# EAGLE schematic cnc_driver_2 (EAGLE 7.6.0)
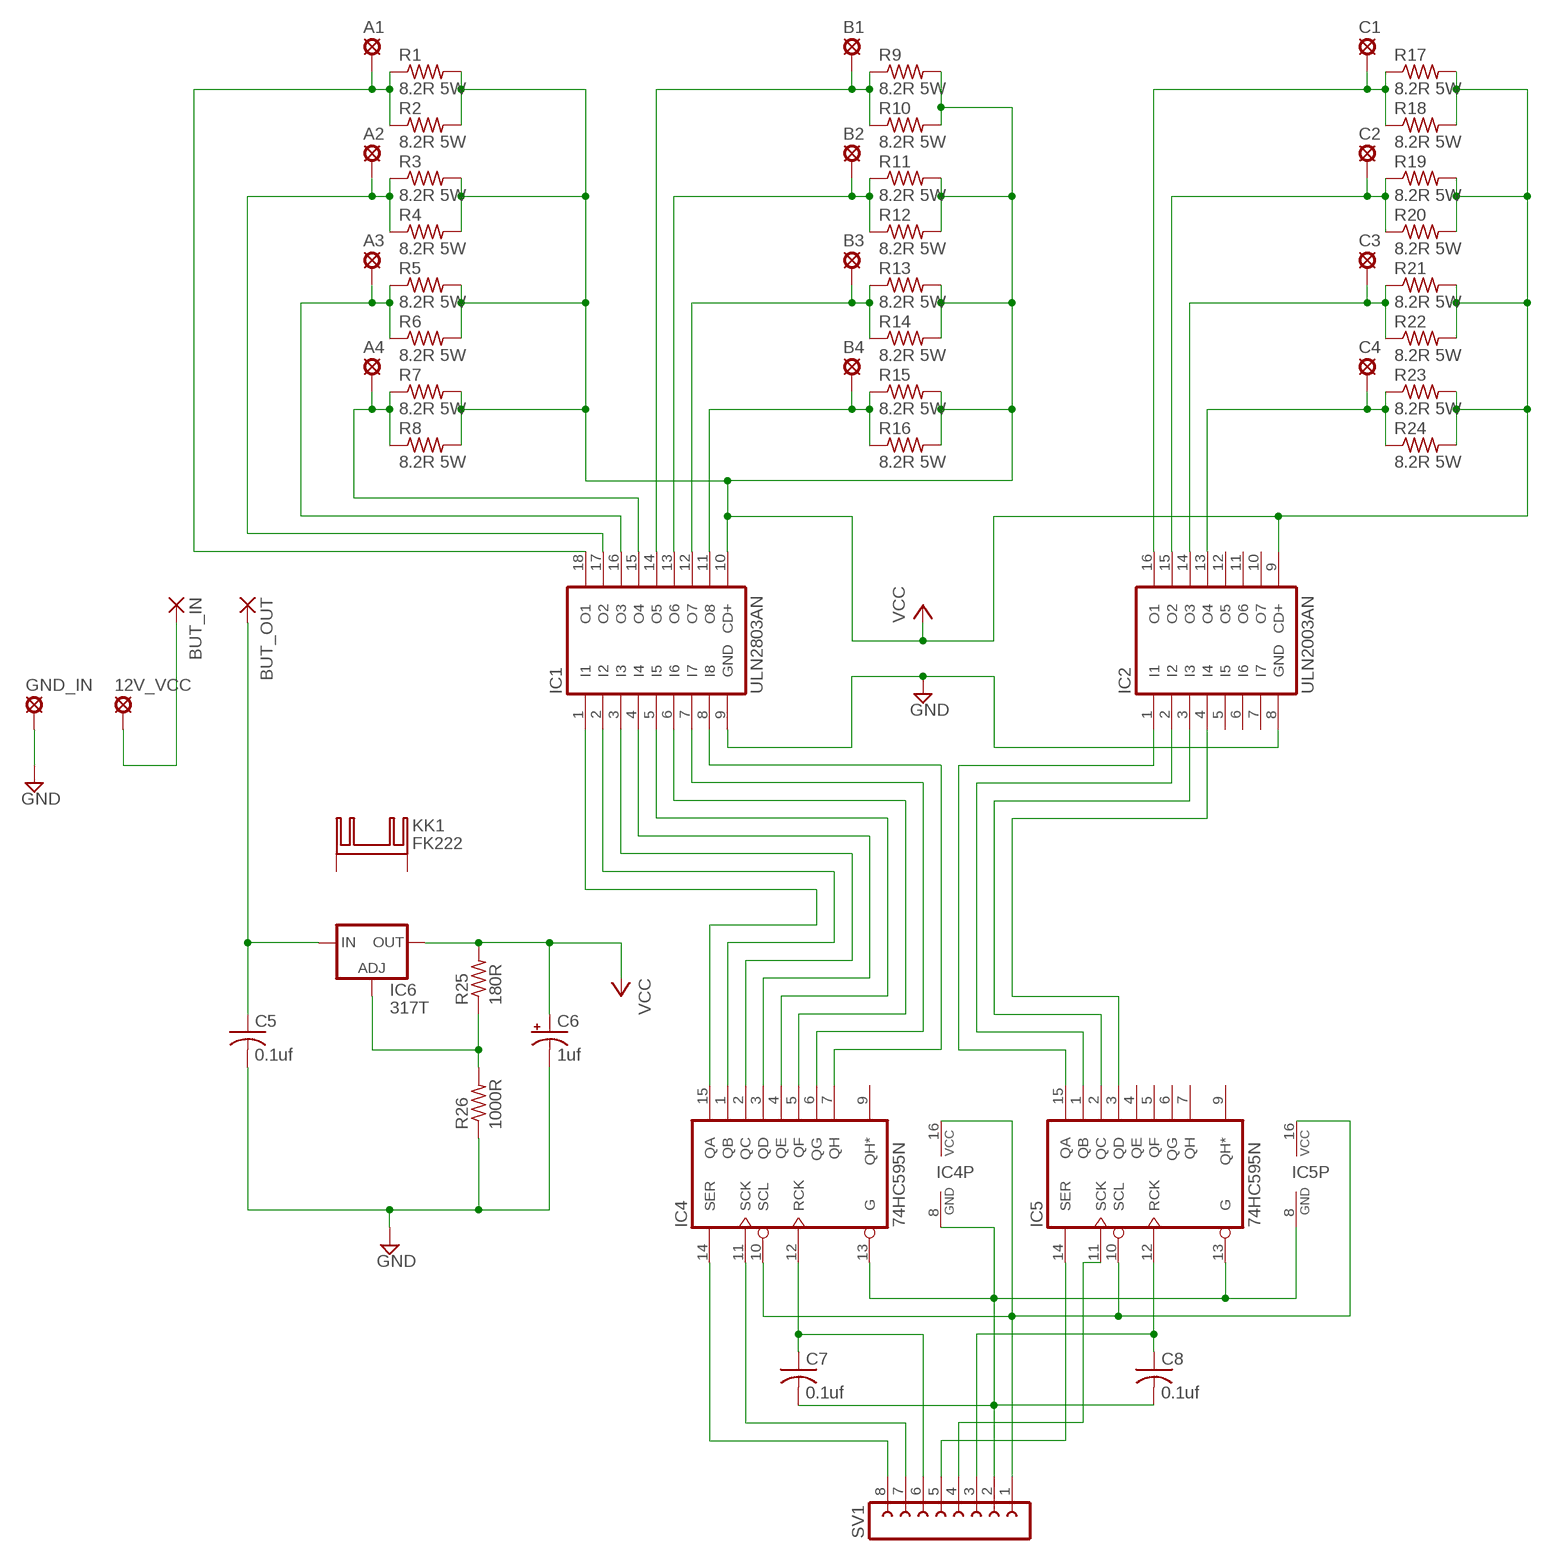
[diagram p0: schematic, sheet 1]

## Parts
12V_VCC  LSP13  [LSP13]
A1  LSP11  [LSP11]
A2  LSP11  [LSP11]
A3  LSP11  [LSP11]
A4  LSP11  [LSP11]
B1  LSP11  [LSP11]
B2  LSP11  [LSP11]
B3  LSP11  [LSP11]
B4  LSP11  [LSP11]
BUT_IN  3,81/1,4  [3,81/1,4]
BUT_OUT  3,81/1,4  [3,81/1,4]
C1  LSP11  [LSP11]
C2  LSP11  [LSP11]
C3  LSP11  [LSP11]
C4  LSP11  [LSP11]
C5  0.1uf  C-US025-025X050  [C025-025X050]
C6  1uf  CPOL-USE2-5  [E2-5]
C7  0.1uf  C-US025-025X050  [C025-025X050]
C8  0.1uf  C-US025-025X050  [C025-025X050]
GND_IN  LSP13  [LSP13]
IC1  ULN2803AN  ULN2803A  [DIL18]
IC2  ULN2003AN  [DIL16]
IC4  74HC595N  [DIL16]
IC5  74HC595N  [DIL16]
IC6  317T  LM317TS  [317TS]
KK1  FK222  [FK222]
R1  8.2R 5W  R-US_0617/5V  [0617V]
R2  8.2R 5W  R-US_0617/5V  [0617V]
R3  8.2R 5W  R-US_0617/5V  [0617V]
R4  8.2R 5W  R-US_0617/5V  [0617V]
R5  8.2R 5W  R-US_0617/5V  [0617V]
R6  8.2R 5W  R-US_0617/5V  [0617V]
R7  8.2R 5W  R-US_0617/5V  [0617V]
R8  8.2R 5W  R-US_0617/5V  [0617V]
R9  8.2R 5W  R-US_0617/5V  [0617V]
R10  8.2R 5W  R-US_0617/5V  [0617V]
R11  8.2R 5W  R-US_0617/5V  [0617V]
R12  8.2R 5W  R-US_0617/5V  [0617V]
R13  8.2R 5W  R-US_0617/5V  [0617V]
R14  8.2R 5W  R-US_0617/5V  [0617V]
R15  8.2R 5W  R-US_0617/5V  [0617V]
R16  8.2R 5W  R-US_0617/5V  [0617V]
R17  8.2R 5W  R-US_0617/5V  [0617V]
R18  8.2R 5W  R-US_0617/5V  [0617V]
R19  8.2R 5W  R-US_0617/5V  [0617V]
R20  8.2R 5W  R-US_0617/5V  [0617V]
R21  8.2R 5W  R-US_0617/5V  [0617V]
R22  8.2R 5W  R-US_0617/5V  [0617V]
R23  8.2R 5W  R-US_0617/5V  [0617V]
R24  8.2R 5W  R-US_0617/5V  [0617V]
R25  180R  R-US_0207/10  [0207/10]
R26  1000R  R-US_0207/10  [0207/10]
SV1  FE08-1  [FE08]

## Nets
GND: C5.2 C6.- GND_IN.MP IC1.9(GND) IC2.8(GND) R26.1
N$1: A1.MP IC1.18(O1) R1.1 R2.1
N$2: A2.MP IC1.17(O2) R3.1 R4.1
N$3: A3.MP IC1.16(O3) R5.1 R6.1
N$4: A4.MP IC1.15(O4) R7.1 R8.1
N$5: 12V_VCC.MP BUT_IN.1(P)
N$6: BUT_OUT.1(P) C5.1 IC6.3(IN)
N$7: IC4.10(SCL) IC4.16(VCC) IC5.10(SCL) IC5.16(VCC) SV1.1
N$8: IC6.1(ADJ) R25.1 R26.2
N$10: C7.2 C8.2 IC4.8(GND) IC4.13(G) IC5.8(GND) IC5.13(G) SV1.2
N$13: B1.MP IC1.14(O5) R9.1 R10.1
N$14: B2.MP IC1.13(O6) R11.1 R12.1
N$15: B3.MP IC1.12(O7) R13.1 R14.1
N$16: B4.MP IC1.11(O8) R15.1 R16.1
N$17: C1.MP IC2.16(O1) R17.1 R18.1
N$18: C2.MP IC2.15(O2) R19.1 R20.1
N$19: C3.MP IC2.14(O3) R21.1 R22.1
N$20: C4.MP IC2.13(O4) R23.1 R24.1
N$21: C8.1 IC5.12(RCK) SV1.3
N$22: C7.1 IC4.12(RCK) SV1.6
N$23: IC4.11(SCK) SV1.7
N$24: IC4.14(SER) SV1.8
N$25: IC1.1(I1) IC4.15(QA)
N$26: IC1.2(I2) IC4.1(QB)
N$27: IC1.3(I3) IC4.2(QC)
N$28: IC1.4(I4) IC4.3(QD)
N$29: IC1.5(I5) IC4.4(QE)
N$30: IC1.6(I6) IC4.5(QF)
N$31: IC1.7(I7) IC4.6(QG)
N$32: IC1.8(I8) IC4.7(QH)
N$33: IC2.1(I1) IC5.15(QA)
N$34: IC2.2(I2) IC5.1(QB)
N$35: IC2.3(I3) IC5.2(QC)
N$36: IC2.4(I4) IC5.3(QD)
N$37: IC5.14(SER) SV1.5
N$38: IC5.11(SCK) SV1.4
VCC: IC1.10(CD+) IC2.9(CD+) R1.2 R2.2 R3.2 R4.2 R5.2 R6.2 R7.2 R8.2 R9.2 R10.2 R11.2 R12.2 R13.2 R14.2 R15.2 R16.2 R17.2 R18.2 R19.2 R20.2 R21.2 R22.2 R23.2 R24.2
VCC_MOTOR: C6.+ IC6.2(OUT) R25.2 ; supply symbol labelled VCC
Unconnected: IC2.5(I5) IC2.6(I6) IC2.7(I7) IC2.10(O7) IC2.11(O6) IC2.12(O5) IC4.9(QH*) IC5.4(QE) IC5.5(QF) IC5.6(QG) IC5.7(QH) IC5.9(QH*) KK1.A2,8(K) KK1.B2,8(K)

## Library data of the parts
12V_VCC GND_IN = solpad:LSP13: SOLDER PAD drill 1.3 mm, distributor Buerklin, 12H562
A1-A4 B1-B4 C1-C4 = solpad:LSP11: SOLDER PAD drill 1.1 mm
BUT_IN BUT_OUT = wirepad:3,81/1,4: THROUGH-HOLE PAD
C5 C7 C8 = rcl:C-US: CAPACITOR, American symbol
C6 = rcl:CPOL-US: POLARIZED CAPACITOR, American symbol
IC1 = uln-udn:ULN2803A: DRIVER ARRAY
IC2 = uln-udn:ULN2003A: DRIVER ARRAY
IC4 IC5 = 74xx-eu:74*595: 8-bit SHIFT REGISTER, output latch
IC6 = v-reg:LM317TS: VOLTAGE REGULATOR
KK1 = heatsink:FK222: HEATSINK manufacturer Fischer/distributor Buerklin
R1-R26 = rcl:R-US_: RESISTOR, American symbol
SV1 = con-lsta:FE08-1: FEMALE HEADER; OC_FARNELL: unknown; OC_NEWARK: unknown